# EAGLE design w14_MAKEYMAKEY-v03(2_3) (EAGLE 6.6.0)

## Sheet 1 of 2: i/o filters
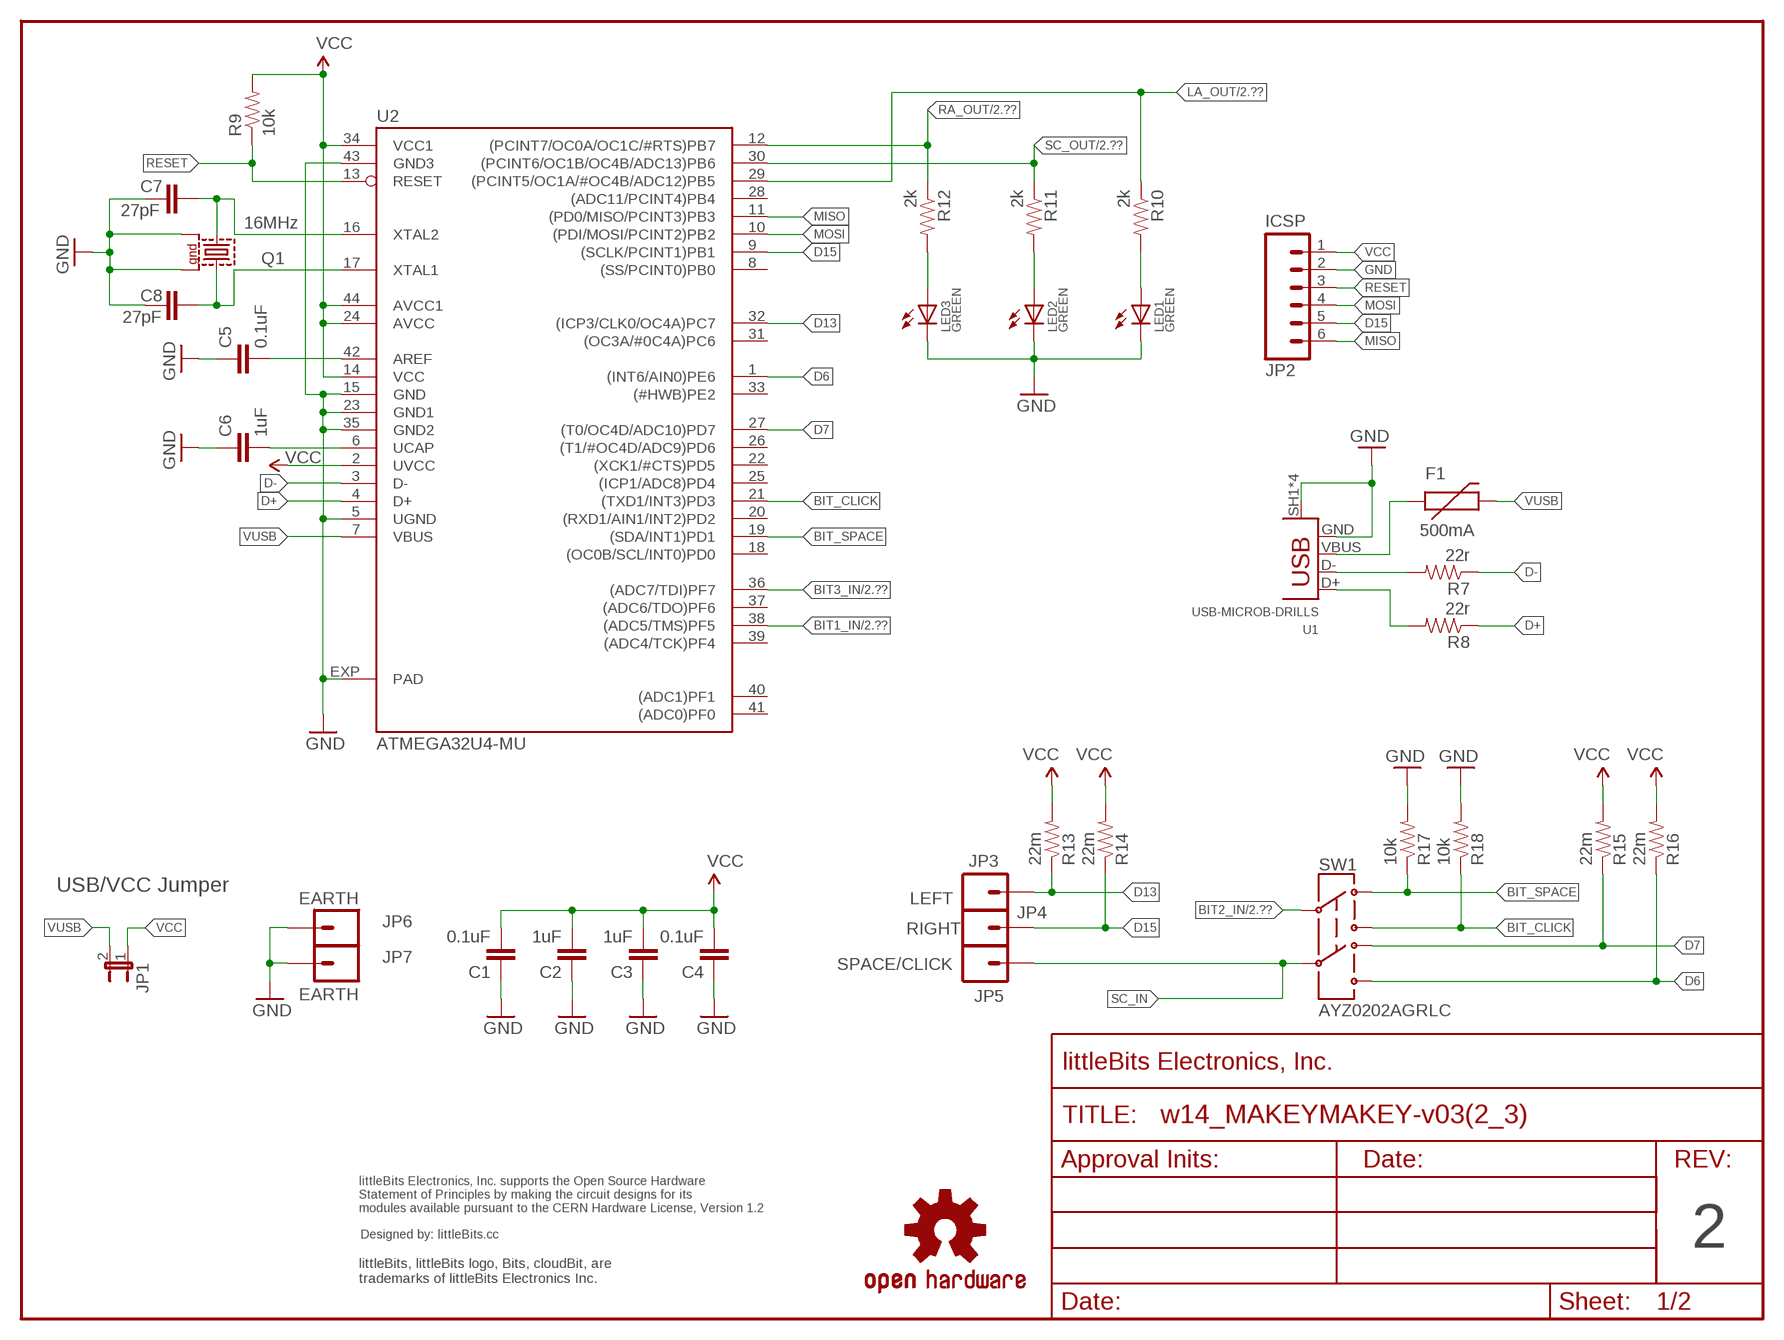
[diagram p0: schematic, sheet 1]

### Parts
C1  0.1uF  CAPCAP-0603  [CAP-0603]
C2  1uF  CAPCAP-0603  [CAP-0603]
C3  1uF  CAPCAP-0603  [CAP-0603]
C4  0.1uF  CAPCAP-0603  [CAP-0603]
C5  0.1uF  CAPCAP-0603  [CAP-0603]
C6  1uF  CAPCAP-0603  [CAP-0603]
C7  27pF  CAPCAP-0603  [CAP-0603]
C8  27pF  CAPCAP-0603  [CAP-0603]
F1  500mA  PTC  [PTC-1206]
JP1  JUMPER-2SMD-NO  [SJ_2S-NO]
JP2  ICSP  HRD-60.1INCH_NO_SILKSCREEN  [SIP6-SM-0.1IN-NOS.S.]
JP3  LEFT  M01ALLIGATOR-3MM  [1X01_ALLIGATOR_3MM]
JP4  RIGHT  M01ALLIGATOR-3MM  [1X01_ALLIGATOR_3MM]
JP5  SPACE/CLICK  M01ALLIGATOR-3MM  [1X01_ALLIGATOR_3MM]
JP6  EARTH  M01ALLIGATOR-3MM  [1X01_ALLIGATOR_3MM]
JP7  EARTH  M01ALLIGATOR-3MM  [1X01_ALLIGATOR_3MM]
LED1  GREEN  LED1206  [LED-1206]
LED2  GREEN  LED1206  [LED-1206]
LED3  GREEN  LED1206  [LED-1206]
Q1  16MHz  CRYSTAL-SMD-7B-SERIES-TXC  [CRYSTAL-SMD-7B-SERIES-5X3.2MM]
R7  22r  RESISTOR0603  [RES-0603]
R8  22r  RESISTOR0603  [RES-0603]
R9  10k  RESISTOR0603  [RES-0603]
R10  2k  RESISTOR0603  [RES-0603]
R11  2k  RESISTOR0603  [RES-0603]
R12  2k  RESISTOR0603  [RES-0603]
R13  22m  RESISTOR0603  [RES-0603]
R14  22m  RESISTOR0603  [RES-0603]
R15  22m  RESISTOR0603  [RES-0603]
R16  22m  RESISTOR0603  [RES-0603]
R17  10k  RESISTOR0603  [RES-0603]
R18  10k  RESISTOR0603  [RES-0603]
SW1  AYZ0202AGRLC  AYZ0202  [AYZ0202]
U1  USB-MICROB-DRILLS  [USB-MICROB-AUK-DRILLS]
U2  ATMEGA32U4-MU  ATMEGA32U4-XUMU  [QFN44ML7X7]
U$1  OSHWCREDIT  [OSHWCREDIT]
U$58  FRAME-LETTER-OHWOHW  [FABDWG01-OHW]
U$70  OSHW-LOGOL  [OSHW-LOGO-L]

### Nets
BIT1_IN: U2.38((ADC5/TMS)PF5) ; also sheet 2
BIT2_IN: SW1.2 ; also sheet 2
BIT3_IN: U2.36((ADC7/TDI)PF7) ; also sheet 2
BIT_CLICK: R18.1 SW1.3 U2.21((TXD1/INT3)PD3)
BIT_SPACE: R17.1 SW1.1 U2.19((SDA/INT1)PD1)
D6: R16.1 SW1.6 U2.1((INT6/AIN0)PE6)
D7: R15.1 SW1.4 U2.27((T0/OC4D/ADC10)PD7)
D13: JP3.1@0 JP3.1@2 R13.1 U2.32((ICP3/CLK0/OC4A)PC7)
D15: JP2.5 JP4.1@0 JP4.1@2 R14.1 U2.9((SCLK/PCINT1)PB1)
D+: R8.1 U2.4(D+)
D-: R7.1 U2.3(D-)
GND: C1.1 C2.1 C3.2 C4.1 C5.1 C6.1 C7.2 C8.2 JP2.2 JP6.1@0 JP6.1@2 JP7.1@0 JP7.1@2 LED1.C LED2.C LED3.C Q1.P$2 Q1.P$4 R17.2 R18.2 U1.GND U1.SH1(SH) U1.SH2(SH) U1.SH3(SH) U1.SH4(SH) U2.5(UGND) U2.15(GND) U2.23(GND1) U2.35(GND2) U2.43(GND3) U2.EXP(PAD) ; also sheet 2
LA_OUT: R10.1 U2.29((PCINT5/OC1A/#OC4B/ADC12)PB5) ; also sheet 2
MISO: JP2.6 U2.11((PD0/MISO/PCINT3)PB3)
MOSI: JP2.4 U2.10((PDI/MOSI/PCINT2)PB2)
N$1: LED3.A R12.2
N$4: LED1.A R10.2
N$5: LED2.A R11.2
N$12: C5.2 U2.42(AREF)
N$14: C7.1 Q1.P$3 U2.16(XTAL2)
N$15: R7.2 U1.D-
N$16: R8.2 U1.D+
N$17: F1.1 U1.VBUS
N$18: C8.1 Q1.P$1 U2.17(XTAL1)
N$19: C6.2 U2.6(UCAP)
RA_OUT: R12.1 U2.12((PCINT7/OC0A/OC1C/#RTS)PB7) ; also sheet 2
RESET: JP2.3 R9.1 U2.13(RESET)
SC_IN: JP5.1@0 JP5.1@2 SW1.5
SC_OUT: R11.1 U2.30((PCINT6/OC1B/OC4B/ADC13)PB6) ; also sheet 2
VCC: C1.2 C2.2 C3.1 C4.2 JP1.1 JP2.1 R9.2 R13.2 R14.2 R15.2 R16.2 U2.2(UVCC) U2.14(VCC) U2.24(AVCC) U2.34(VCC1) U2.44(AVCC1) ; also sheet 2
VUSB: F1.2 JP1.2 U2.7(VBUS)
Unconnected: U2.8((SS/PCINT0)PB0) U2.18((OC0B/SCL/INT0)PD0) U2.20((RXD1/AIN1/INT2)PD2) U2.22((XCK1/#CTS)PD5) U2.25((ICP1/ADC8)PD4) U2.26((T1/#OC4D/ADC9)PD6) U2.28((ADC11/PCINT4)PB4) U2.31((OC3A/#0C4A)PC6) U2.33((#HWB)PE2) U2.37((ADC6/TDO)PF6) U2.39((ADC4/TCK)PF4) U2.40((ADC1)PF1) U2.41((ADC0)PF0)

### Notes on the sheet
- USB/VCC Jumper
- 2

## Sheet 2 of 2
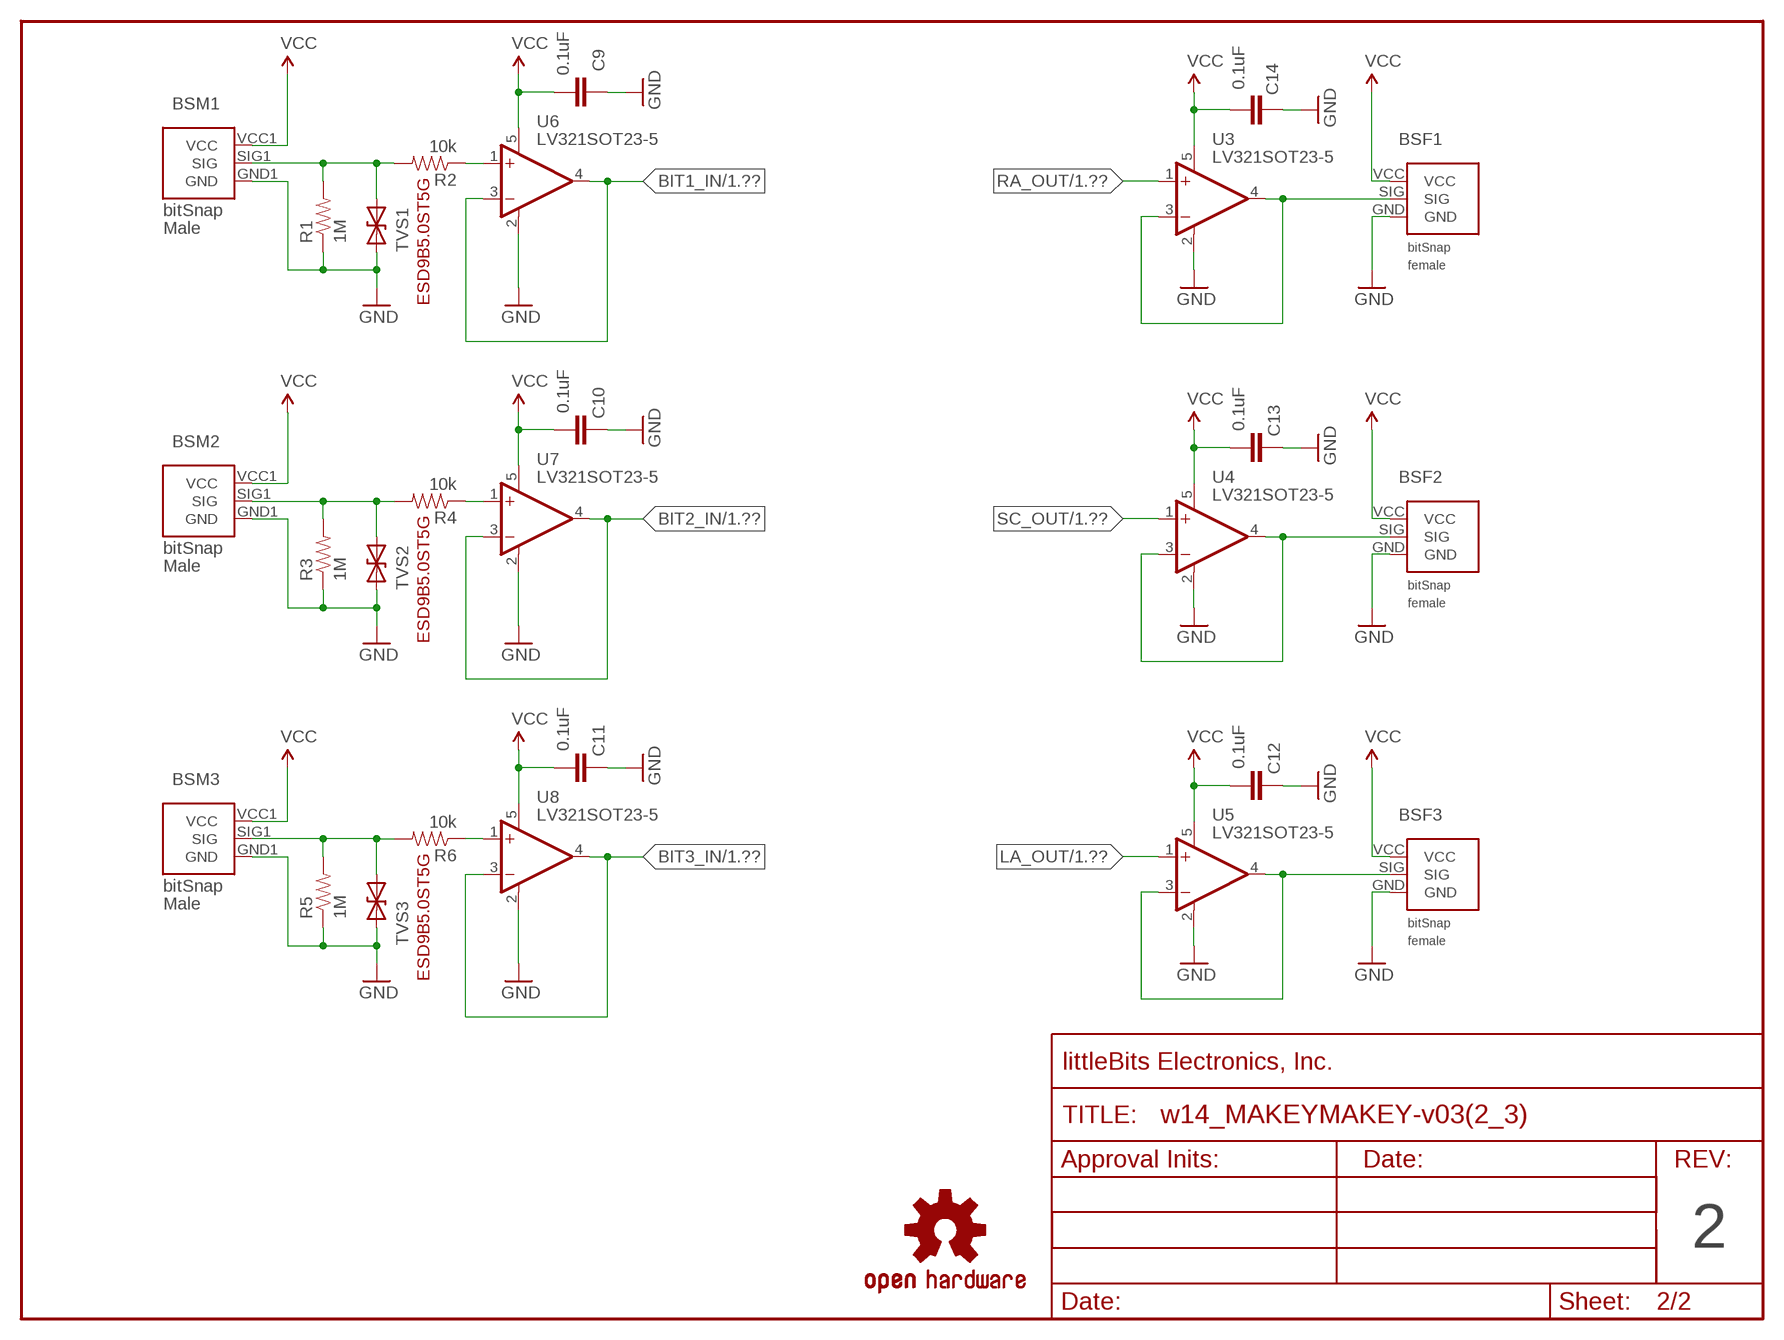
[diagram p1: schematic, sheet 2]

### Parts
BSF1  BITSNAP_V03_FEMALE  [BITSNAP_V03_FEMALE]
BSF2  BITSNAP_V03_FEMALE  [BITSNAP_V03_FEMALE]
BSF3  BITSNAP_V03_FEMALE  [BITSNAP_V03_FEMALE]
BSM1  BITSNAP_V03_MALE  [BITSNAP_V03_MALE]
BSM2  BITSNAP_V03_MALE  [BITSNAP_V03_MALE]
BSM3  BITSNAP_V03_MALE  [BITSNAP_V03_MALE]
C9  0.1uF  CAPCAP-0603  [CAP-0603]
C10  0.1uF  CAPCAP-0603  [CAP-0603]
C11  0.1uF  CAPCAP-0603  [CAP-0603]
C12  0.1uF  CAPCAP-0603  [CAP-0603]
C13  0.1uF  CAPCAP-0603  [CAP-0603]
C14  0.1uF  CAPCAP-0603  [CAP-0603]
R1  1M  RESISTOR0603  [RES-0603]
R2  10k  RESISTOR0603  [RES-0603]
R3  1M  RESISTOR0603  [RES-0603]
R4  10k  RESISTOR0603  [RES-0603]
R5  1M  RESISTOR0603  [RES-0603]
R6  10k  RESISTOR0603  [RES-0603]
TVS1  ESD9B5.0ST5G  DIODE-TVSSOD-923  [SOD-923]
TVS2  ESD9B5.0ST5G  DIODE-TVSSOD-923  [SOD-923]
TVS3  ESD9B5.0ST5G  DIODE-TVSSOD-923  [SOD-923]
U3  LV321SOT23-5  [SOT23-5]
U4  LV321SOT23-5  [SOT23-5]
U5  LV321SOT23-5  [SOT23-5]
U6  LV321SOT23-5  [SOT23-5]
U7  LV321SOT23-5  [SOT23-5]
U8  LV321SOT23-5  [SOT23-5]
U$2  FRAME-LETTER-OHWOHW  [FABDWG01-OHW]
U$56  OSHW-LOGOL  [OSHW-LOGO-L]

### Nets
BIT1_IN: U6.3(-IN) U6.4(OUT) ; also sheet 1
BIT2_IN: U7.3(-IN) U7.4(OUT) ; also sheet 1
BIT3_IN: U8.3(-IN) U8.4(OUT) ; also sheet 1
GND: BSF1.GND BSF2.GND BSF3.GND BSM1.GND1(GND) BSM2.GND1(GND) BSM3.GND1(GND) C9.1 C10.1 C11.1 C12.1 C13.1 C14.1 R1.1 R3.1 R5.1 TVS1.1(A) TVS2.1(A) TVS3.1(A) U3.2(V-) U4.2(V-) U5.2(V-) U6.2(V-) U7.2(V-) U8.2(V-) ; also sheet 1
LA_OUT: U5.1(+IN) ; also sheet 1
N$6: R4.1 U7.1(+IN)
N$10: R2.1 U6.1(+IN)
N$11: R6.1 U8.1(+IN)
RA_OUT: U3.1(+IN) ; also sheet 1
SC_OUT: U4.1(+IN) ; also sheet 1
SIG1_IN: BSM1.SIG1(SIG) R1.2 R2.2 TVS1.2(C)
SIG1_OUT: BSF1.SIG U3.3(-IN) U3.4(OUT)
SIG2_IN: BSM2.SIG1(SIG) R3.2 R4.2 TVS2.2(C)
SIG2_OUT: BSF2.SIG U4.3(-IN) U4.4(OUT)
SIG3_IN: BSM3.SIG1(SIG) R5.2 R6.2 TVS3.2(C)
SIG3_OUT: BSF3.SIG U5.3(-IN) U5.4(OUT)
VCC: BSF1.VCC BSF2.VCC BSF3.VCC BSM1.VCC1(VCC) BSM2.VCC1(VCC) BSM3.VCC1(VCC) C9.2 C10.2 C11.2 C12.2 C13.2 C14.2 U3.5(V+) U4.5(V+) U5.5(V+) U6.5(V+) U7.5(V+) U8.5(V+) ; also sheet 1

### Notes on the sheet
- 2

## Library data of the parts
BSF1-BSF3 = bitSnap:BITSNAP_V03_FEMALE
BSM1-BSM3 = bitSnap:BITSNAP_V03_MALE
C1-C14 = LITTLEBITS:CAP
F1 = LITTLEBITS:PTC
JP1 = LITTLEBITS:JUMPER-2: Jumper Basic 0.1" spaced jumper. Use with breakaway headers.
JP2 = LITTLEBITS:HRD-6
JP3-JP7 = SparkFun-Connectors:M01: Header 1 Standard 1-pin 0.1" header. Use with straight break away headers (SKU : PRT-00116), right angle break away headers (PRT-00553), swiss pins (PRT-00743), machine pins (PRT-00117), and female headers (PRT-00115).
LED1-LED3 = LITTLEBITS:LED
Q1 = LITTLEBITS:CRYSTAL-SMD-7B-SERIES-TXC; MFG: TXC; MPN: 7B SERIES
R1-R18 = LITTLEBITS:RESISTOR
SW1 = LITTLEBITS:AYZ0202
TVS1-TVS3 = LITTLEBITS:DIODE-TVS: Bidirectional Transient Voltage Suppression Diode: Device conducts in avalanche mode after reaching a part dependent voltage threshold. Used for limiting voltage spikes on ESD sensitive inputs and outputs.; IEC_ESD_PROT0: +/-18kV; LB_PN: ?; MPN: ESD9B5.0ST5G; V_CLAMP: ?; V_OPERATION: 5V
U1 = LITTLEBITS:USB-MICROB-DRILLS: AUK micro USB connector Part #: MCSB5ABSW-4-GXX-R1K-H; MFG: AUK; MPN: MCSB5ABSW-4-GXX-R1K-H
U2 = LITTLEBITS:ATMEGA32U4-XU
U3-U8 = LITTLEBITS:LV321
U$1 = LITTLEBITS:OSHWCREDIT
U$2 U$58 = LITTLEBITS:FRAME-LETTER-OHW
U$56 U$70 = LITTLEBITS:OSHW-LOGO: Open Source Hardware Logo This logo indicates the piece of hardware it is found on incorporates a OSHW license and/or adheres to the definition of open source hardware found here: http://freedomdefined.org/OSHW

## Board
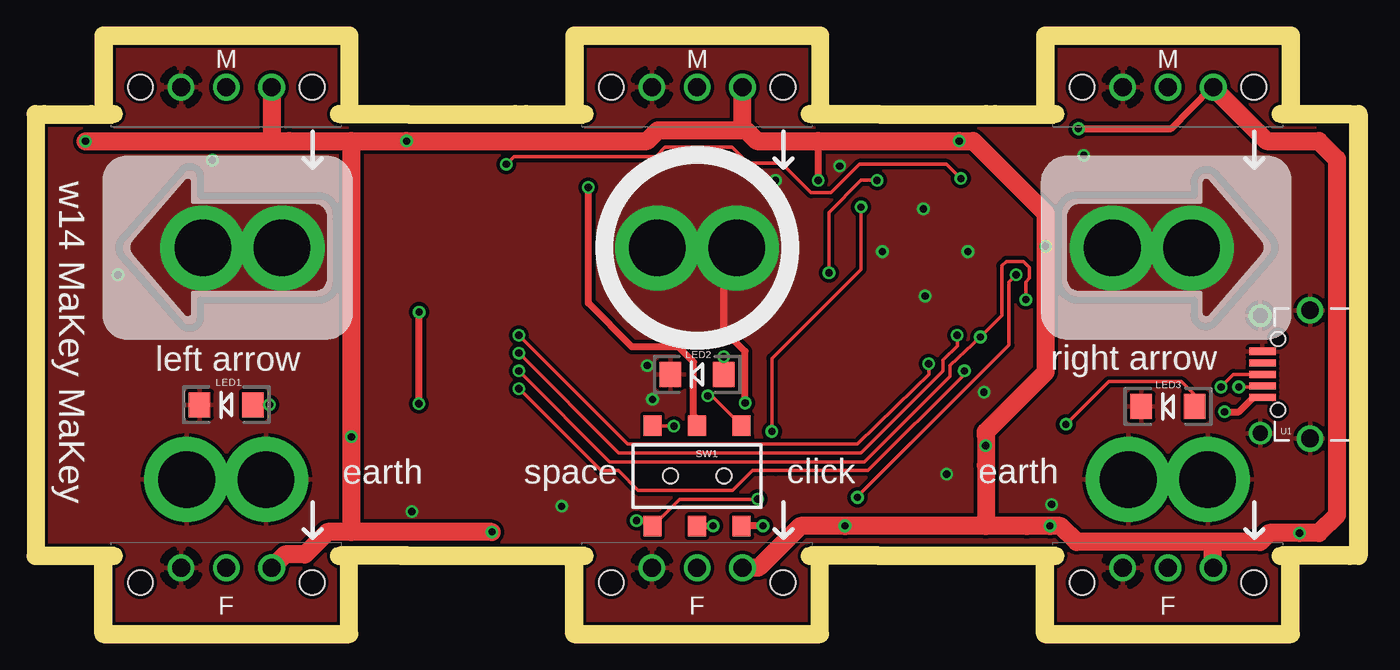
[diagram p2: board, top side]
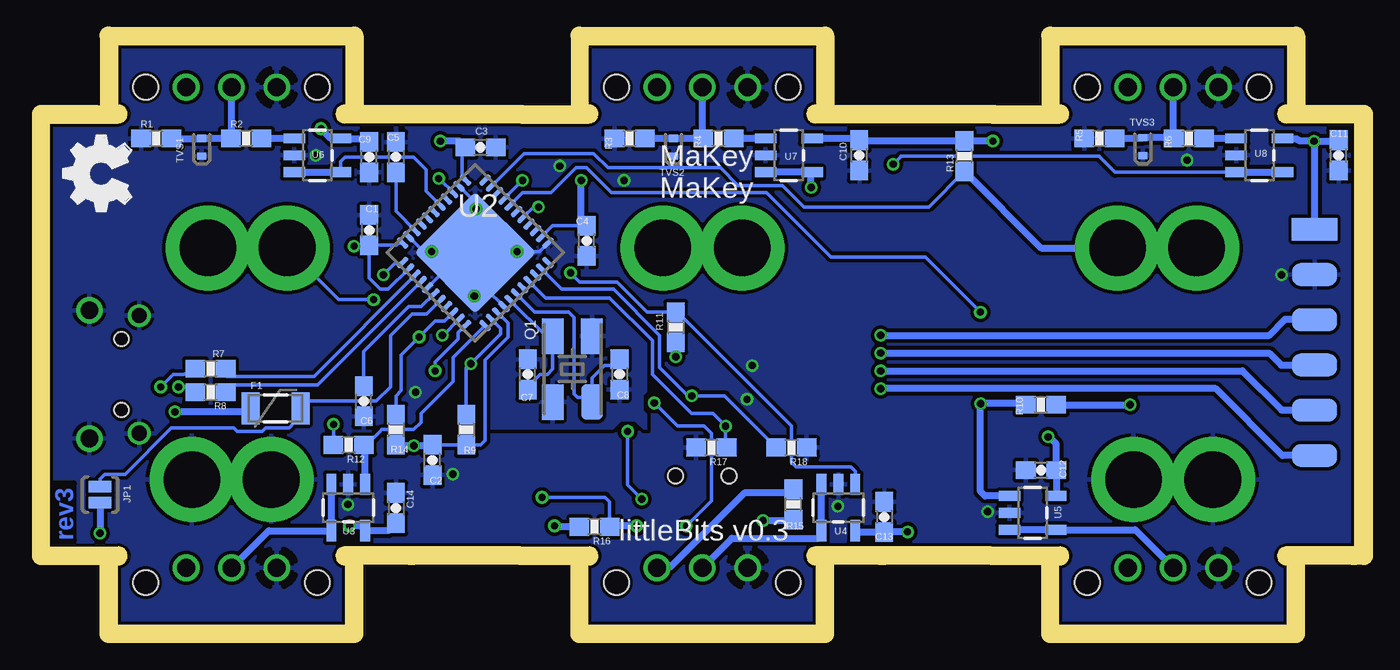
[diagram p3: board, bottom side, seen from below]

Size 73.24 x 32.61 mm. Coordinates in mm from the lower left corner, seen from the top.
Outline: 73.24,4.4 73.24,28.21
Outline: 20.4,28.21 26.42,28.21
Outline: 0,4.4 0,28.21
Outline: 20.4,4.4 26.42,4.4
Outline: 46.82,4.4 52.84,4.4
Outline: 46.82,28.21 52.84,28.21
Copper layers (1*16): Top 0.035mm / dielectric 1.5mm / Bottom 0.035mm
Design rules "littleBitsDRC": minimum track width 0.2mm, minimum drill 0.2mm, track to track 0.2mm, track to pad 0.2mm, pad to pad 0.2mm, via to via 0.2mm, smd to smd 0mil, copper to edge 0.2mm, drill to drill 0.2mm, minimum pad ring 0.1mm, minimum via ring 0.15mm, stop-mask expansion 0.1mm, vias tented up to drill 0.5mm, thermal gap 0.2mm
tRestrict: 30 lines
bRestrict: 17 lines
Milling: 10 lines

### Footprints (pad centres in the part's own frame; a part is rotated, then mirrored left to right if it is on the bottom)
BITSNAP_V03_FEMALE = drill 1: GND 4.065,3.44; SIG 6.605,3.44; VCC 9.145,3.44 | hole 1.4: 1.785,2.61; 11.425,2.61
BITSNAP_V03_MALE = drill 1: GND1 9.145,2.61; SIG1 6.605,2.61; VCC1 4.065,2.61 | hole 1.4: 1.785,2.61; 11.425,2.61
CAP-0603 = smd 1.1 x 1: 1 -0.85,0; 2 0.85,0
PTC-1206 = smd 1 x 1.8: 1 -1.4,0; 2 1.4,0
SJ_2S-NO = smd 0.635 x 1.27: 1 -0.45,0; 2 0.45,0
SIP6-SM-0.1IN-NOS.S. = smd 1.27 x 2.54: 1 -6.35,0; 2 -3.81,0; 3 -1.27,0; 4 1.27,0; 5 3.81,0; 6 6.35,0
1X01_ALLIGATOR_3MM = drill 3.175: 1@0 0,2.223; 1@2 0,-2.223
LED-1206 = smd 1.2 x 1.4: A -1.5,0; C 1.5,0
CRYSTAL-SMD-7B-SERIES-5X3.2MM = smd 2 x 1.2: P$1 -1.85,-1.1; P$2 1.85,-1.1; P$3 1.85,1.1; P$4 -1.85,1.1
RES-0603 = smd 1.1 x 1: 1 -0.85,0; 2 0.85,0
AYZ0202 = smd 1 x 1.15: 1 -2.5,2.825; 2 0,2.825; 3 2.5,2.825; 4 -2.5,-2.825; 5 0,-2.825; 6 2.5,-2.825 | hole 0.85: 1.5,0; -1.5,0
SOD-923 = smd 0.4 x 0.5: 1 -0.5,0; 2 0.5,0
USB-MICROB-AUK-DRILLS = smd 0.4 x 1.5: D+ 0,2.67; D- -0.65,2.67; GND 1.3,2.67; ID 0.65,2.67; VBUS -1.3,2.67 | drill 0.85: SH1 -3.3,2.8; SH2 3.3,2.8 | drill 1: SH3 -3.6,0; SH4 3.6,0 | hole 0.8: -2,1.8; 2,1.8
QFN44ML7X7 = smd 0.75 x 0.275: 1 -3.275,2.5; 2 -3.275,2; 3 -3.275,1.5; 4 -3.275,1; 5 -3.275,0.5; 6 -3.275,0; 7 -3.275,-0.5; 8 -3.275,-1; 9 -3.275,-1.5; 10 -3.275,-2; 11 -3.275,-2.5; 23 3.275,-2.5; 24 3.275,-2; 25 3.275,-1.5; 26 3.275,-1; 27 3.275,-0.5; 28 3.275,0; 29 3.275,0.5; 30 3.275,1; 31 3.275,1.5; 32 3.275,2; 33 3.275,2.5 | smd 0.275 x 0.75: 12 -2.5,-3.275; 13 -2,-3.275; 14 -1.5,-3.275; 15 -1,-3.275; 16 -0.5,-3.275; 17 0,-3.275; 18 0.5,-3.275; 19 1,-3.275; 20 1.5,-3.275; 21 2,-3.275; 22 2.5,-3.275; 34 2.5,3.275; 35 2,3.275; 36 1.5,3.275; 37 1,3.275; 38 0.5,3.275; 39 0,3.275; 40 -0.5,3.275; 41 -1,3.275; 42 -1.5,3.275; 43 -2,3.275; 44 -2.5,3.275 | smd 4.826 x 4.826: EXP 0,0
SOT23-5 = smd 0.55 x 1.2: 1 -0.95,-1.3; 2 0,-1.3; 3 0.95,-1.3; 4 0.95,1.3; 5 -0.95,1.3

### Placement (x,y rotation side)
BSF1  56.44,-0.21 0 top
BSF2  30.02,-0.21 0 top
BSF3  3.59,-0.21 0 top
BSM1  69.65,32.82 180 top
BSM2  43.23,32.82 180 top
BSM3  16.8,32.82 180 top
C1  55.31,22.18 270 bottom
C2  51.77,9.29 90 bottom
C3  49.06,26.83 0 bottom
C4  43.12,21.58 90 bottom
C5  53.81,26.29 270 bottom
C6  55.62,12.58 90 bottom
C7  46.41,14.08 90 bottom
C8  41.27,14.08 270 bottom
C9  55.31,26.29 90 bottom
C10  27.82,26.39 90 bottom
C11  0.91,26.39 90 bottom
C12  17.62,8.71 0 bottom
C13  26.41,6.08 270 bottom
C14  53.81,6.58 270 bottom
F1  60.56,12.18 0 bottom
JP1  70.41,7.33 90 bottom
JP2  2.27,15.88 270 bottom
JP3  11.1,21.18 90 top
JP4  62.14,21.18 90 top
JP5  36.62,21.18 90 top
JP6  10.2,8.18 90 top
JP7  63.04,8.18 90 top
LED1  10.2,12.38 180 top
LED2  36.62,14.08 180 top
LED3  63.04,12.29 180 top
Q1  43.91,14.38 90 bottom
R1  67.26,27.33 0 bottom
R2  62.22,27.33 180 bottom
R3  40.7,27.33 0 bottom
R4  35.72,27.33 180 bottom
R5  14.34,27.33 0 bottom
R6  9.32,27.33 180 bottom
R7  64.22,14.4 180 bottom
R8  64.22,13.08 180 bottom
R9  49.87,10.98 270 bottom
R10  17.62,12.38 0 bottom
R11  38.12,16.73 270 bottom
R12  56.47,10.13 180 bottom
R13  21.91,26.33 90 bottom
R14  53.81,10.98 270 bottom
R15  31.52,6.78 90 bottom
R16  42.66,5.53 180 bottom
R17  36.12,9.98 180 bottom
R18  31.62,9.98 0 bottom
SW1  36.62,8.38 0 top
TVS1  64.72,26.83 90 bottom
TVS2  38.23,26.83 90 bottom
TVS3  11.91,26.87 90 bottom
U1  71.02,14.08 90 top
U2  49.37,20.91 45 bottom
U3  56.49,6.61 180 bottom
U4  28.99,6.61 180 bottom
U5  18.09,6.32 270 bottom
U6  58.22,26.39 270 bottom
U7  31.77,26.39 270 bottom
U8  5.37,26.39 270 bottom
U$1  -59.51,-62.54 0 top  (outside the outline)
U$2  30.02,-6.82 0 top  (outside the outline)
U$5  [OSHW_FILLX150_NOTEXT]  68.67,22.41 0 top
U$56  2.32,-68.86 0 top  (outside the outline)
U$58  30.02,-6.82 0 top  (outside the outline)
U$70  2.32,-68.86 0 top  (outside the outline)

### Tracks (layer width: path | path; a pad name or v marks a point on that pad's centre or on a via)
BIT1_IN
  Bottom 0.2: U6.4 56.91,26.03 56.66,26.29 52.81,26.29 52.12,25.58 52.12,24.38
  Bottom 0.203: 52.12,24.38 51.33,23.6 U2.38
  Bottom 0.406: U6.3 U6.4
BIT2_IN  (via drill 0.41)
  Top 0.203: 36.62,11.58 SW1.2
  Top 0.406: v30.52,24.58 30.52,18.08 32.97,15.63 35.56,15.63 36.41,14.79 36.41,11.79 36.62,11.58
  Bottom 0.203: 30.52,25.39 U7.4
  Bottom 0.406: U7.4 U7.3 | v30.52,24.58 30.52,25.39
BIT3_IN  (via drill 0.41)
  Top 0.203: v51.41,25.08 50.62,25.89 45.72,25.89 44.12,24.29 43.02,24.29 41.37,25.93 39.47,25.93 38.56,26.83 34.81,26.83 34.3,26.32 26.36,26.32
  Top 0.204: v25.91,25.89 26.36,26.32
  Bottom 0.2: 25.48,26.32 25.46,26.33 14.36,26.33 14.36,26.32
  Bottom 0.203: U2.36 50.62,24.31 51.31,25.01
  Bottom 0.204: U8.3 13.46,25.43 14.36,26.32 | 25.48,26.32 v25.91,25.89 | v51.41,25.08 51.31,25.01
  Bottom 0.406: U8.3 U8.4
BIT_CLICK  (via drill 0.41)
  Top 0.203: v37.22,12.88 37.44,12.88 SW1.3
  Bottom 0.2: 44.52,18.88 41.62,18.88 39.02,16.29 39.02,14.48 37.41,12.88 v37.22,12.88 | U2.21
  Bottom 0.203: v37.22,12.88 35.37,12.88 32.77,10.28 R18.1 | 44.52,18.88 U2.21
BIT_SPACE  (via drill 0.41)
  Top 0.203: v35.31,11.18 34.14,11.18 SW1.1
  Bottom 0.2: 37.22,11.88 39.41,14.08 39.41,15.98 41.81,18.38 45.42,18.38 U2.19
  Bottom 0.203: 37.22,11.88 36.02,11.88 v35.31,11.18 35.31,10.04 R17.1
D6  (via drill 0.41)
  Top 0.2: v54.52,19.68 54.12,19.29 54.12,15.73
  Top 0.203: 39.14,5.58 SW1.6 | 54.12,15.73 45.62,7.24 v45.62,7.18
  Top 0.406: v40.31,5.58 39.14,5.58
  Bottom 0.203: 41.77,5.58 R16.1 41.81,6.93 42.07,7.18 v45.62,7.18 | v54.52,19.68 53.9,20.3 53.52,20.3 U2.1
  Bottom 0.406: v40.31,5.58 41.77,5.58
D7  (via drill 0.41)
  Top 0.203: 34.29,5.56 SW1.4 | 33.79,5.88 SW1.4 | 33.99,5.88 SW1.4 | v40.02,7.08 35.64,7.08 SW1.4 | v45.81,23.48 45.81,19.98 40.81,14.98 v40.81,10.88
  Top 0.406: v33.22,5.88 33.99,5.88
  Bottom 0.203: 31.66,5.88 arc-90 R15.1 | v45.81,23.48 46.02,23.56 U2.27 | v40.02,7.08 40.81,7.88 v40.81,10.88
  Bottom 0.406: v33.22,5.88 31.66,5.88
D13
  Bottom 0.2: 30.91,23.48 32.12,24.68 34.62,24.68 35.62,25.68 41.91,25.68 42.72,26.48 46.62,26.48
  Bottom 0.203: 47.12,25.98 U2.32
  Bottom 0.204: R13.1 23.91,23.48 30.91,23.48 | 46.62,26.48 47.12,25.98
  Bottom 0.406: JP3.1@0 JP3.1@2 17.62,21.18 R13.1
  pour Top (no thermals): 8.53,18.45 15.33,18.45 arc90 16.15,19.26 16.15,23.12 arc90 15.33,23.93 8.53,23.93 8.53,25.27 arc139 7.83,25.35 4.57,21.6 arc81 4.57,20.78 7.83,17.03 arc139 8.53,17.31
D15  (via drill 0.41)
  Top 0.2: v26.62,14.29 31.71,9.18 46.02,9.18 50.81,13.98 50.81,14.58 v52.52,16.18 53.72,17.38 53.72,20.18 | v55.06,18.29 55.06,19.29 55.27,19.48
  Top 0.203: 55.27,19.48 55.27,20.08 54.91,20.43 53.97,20.43 53.72,20.18
  Bottom 0.2: 51.72,16.98 51.62,17.08 51.09,17.08 | v55.06,18.29 57.02,18.29 57.32,18.58
  Bottom 0.203: 2.36,11.98 JP2.5 | R14.1 53.81,12.88 53.52,13.18 53.52,15.18 v52.52,16.18 51.72,16.98 | 57.32,18.58 JP4.1@0 | U2.9 51.07,17.08 51.09,17.08
  Bottom 0.406: v26.62,14.29 6.32,14.29 4.12,12.08 JP2.5
  pour Top (rank 2, no thermals): 64.72,23.94 57.91,23.94 arc90 57.09,23.13 57.09,19.47 arc90 58.01,18.46 64.72,18.46 64.72,17.42 arc139 65.51,17.14 68.67,20.79 arc81 68.67,21.61 65.51,25.26 arc139 64.72,24.78
D+
  Bottom 0.203: R8.1 63.66,13.13 63.31,13.48 58.21,13.48 U2.4
D-
  Bottom 0.203: R7.1 63.66,14.33 63.31,13.98 58.42,13.98 U2.3
GND  (via drill 0.41)
  Bottom 0.203: U2.15 48.75,18.88 48.91,18.88 | 48.91,18.88 49.31,18.48 v49.41,18.48 | U2.23 45.76,20.98 v47.02,20.98 | U2.35 49.31,23.69 v49.31,23.38 | U2.43 52.26,20.98 v51.81,20.98 51.81,20.88 51.02,20.08 51.02,19.97 U2.5 | 48.91,18.88 49.37,19.33 U2.EXP
  other vias: 44.62,25.79 41.02,24.98 29.02,6.68 20.62,6.38 56.52,6.78 58.31,26.39 9.41,26.11 4.12,19.68 33.81,14.58 34.12,12.68 52.72,13.08 50.62,8.48
  pour Top (rank 6): -0.96,-0.24 -0.96,32.73 74,32.73 73.8,-0.24
  pour Bottom: -0.96,-0.24 -0.96,32.73 74,32.73 73.9,-0.24
LA_OUT  (via drill 0.41)
  Top 0.406: v21.01,12.45 21.01,17.38 v21.02,17.58
  Bottom 0.2: 29.41,20.68 33.02,24.29 41.72,24.29 43.12,25.68 43.72,25.68 45.12,24.29 46.72,24.29
  Bottom 0.203: U2.29 47.4,23.6 46.72,24.29 | 24.12,20.68 29.41,20.68
  Bottom 0.204: v21.02,17.58 24.12,20.68
  Bottom 0.406: U5.1 20.75,7.26 21.01,7.52 v21.01,12.45 18.52,12.45 R10.1
MISO  (via drill 0.41)
  Top 0.2: 40.41,8.68 41.02,8.68
  Top 0.203: 41.02,8.68 46.22,8.68 51.62,14.08 v51.62,14.29 | v26.62,13.29 31.21,8.68 32.22,8.68 33.31,7.58 38.62,7.58 39.72,8.68 40.41,8.68
  Bottom 0.203: v51.62,14.29 51.62,14.79 50.31,16.08 50.31,16.43 U2.11
  Bottom 0.4: 7.82,13.29 v26.62,13.29
  Bottom 0.406: JP2.6 4.07,9.54 7.82,13.29
MOSI  (via drill 0.41)
  Top 0.2: v26.62,15.29 32.22,9.68 45.81,9.68 50.41,14.29 50.41,14.88
  Top 0.203: 50.41,14.88 51.22,15.68 v51.22,16.29
  Bottom 0.203: U2.10 51.17,16.29 v51.22,16.29
  Bottom 0.406: v26.62,15.29 4.82,15.29 4.14,14.61 JP2.4
N$1  (via drill 0.41)
  Top 0.203: LED3.A 64.54,12.93 63.79,13.68 59.72,13.68 v57.31,11.29
  Bottom 0.203: v57.31,11.29 R12.2
N$4  (via drill 0.41)
  Top 0.203: v12.62,12.38 LED1.A
  Bottom 0.406: R10.2 v12.62,12.38
N$5  (via drill 0.41)
  Top 0.203: 38.12,13.98 LED2.A v38.12,15.08
  Top 0.406: LED2.A 38.22,13.68
  Bottom 0.203: R11.2 v38.12,15.08
N$6
  Bottom 0.406: U7.1 R4.1
N$10
  Bottom 0.406: U6.1 R2.1
N$11
  Bottom 0.406: U8.1 R6.1
N$12
  Bottom 0.203: U2.42 53.81,23.24 C5.2
N$14
  Bottom 0.203: U2.16 45.39,16.23 Q1.P$3 45.02,14.38 45.31,14.08 45.72,14.08 46.41,13.38 C7.1 46.41,13.48
N$15  (via drill 0.41)
  Top 0.203: U1.D- 67.97,13.43 67.91,13.38 v67.02,13.38
  Bottom 0.203: v67.02,13.38 66.31,14.08 65.72,14.08 R7.2
N$16  (via drill 0.41)
  Top 0.2: U1.D+ 66.72,14.08
  Top 0.203: v66.02,13.38 66.72,14.08
  Bottom 0.203: R8.2 65.52,13.38 v66.02,13.38
N$17  (via drill 0.41)
  Top 0.406: v66.22,11.98 67.02,11.98 67.81,12.79 U1.VBUS
  Bottom 0.406: F1.1 62.37,11.98 v66.22,11.98
N$18
  Bottom 0.203: U2.17 46.03,17.58 44.12,17.58 43.81,17.29 43.81,12.98 43.62,12.79 43.06,12.79 arc90 Q1.P$1 42.81,13.88 42.12,14.58 41.62,14.58 C8.1 41.56,14.93
N$19
  Bottom 0.2: U2.6 52.39,17.88 53.12,17.88 55.62,15.38
  Bottom 0.203: 55.62,15.38 C6.2
RA_OUT
  Bottom 0.2: 54.72,10.88 54.62,10.98 52.81,10.98 52.41,11.38
  Bottom 0.203: U2.12 50.62,15.03 50.62,13.68 52.41,11.88 52.41,11.38 | 54.72,10.88 55.47,10.13 R12.1 55.54,10.06
  Bottom 0.406: U3.1 55.54,10.06
RESET  (via drill 0.41)
  Top 0.2: 45.62,10.18 32.72,10.18 v26.62,16.29
  Top 0.203: 45.62,10.18 48.81,13.29 49.62,14.08 v49.62,14.68
  Bottom 0.2: v49.62,14.68 47.94,16.36 47.94,16.66 U2.13
  Bottom 0.203: 2.3,17.18 JP2.3 | v49.62,14.68 49.87,14.43 R9.1
  Bottom 0.406: v26.62,16.29 4.82,16.29 3.91,17.18 2.3,17.18
SC_IN  (via drill 0.41)
  Top 0.203: SW1.5 36.64,5.58 | 38.22,21.18 JP5.1@2 | 38.12,21.08 38.22,21.18 | 38.22,21.18 JP5.1@0
  Top 0.406: 36.64,5.58 v37.52,5.58 | v39.31,12.48 39.31,15.38 38.12,16.58 38.12,21.08
  Bottom 0.2: v39.31,12.48 38.02,11.18 36.52,11.18 36.12,10.79 36.12,6.99 v37.52,5.58
  pour Top (no thermals): 36.56,26.08 arc90 31.68,21.2 31.68,21.13 arc90 36.62,16.29 arc90 41.52,21.18 arc90
SC_OUT  (via drill 0.41)
  Top 0.203: v46.72,24.98 45.81,24.98 44.02,23.18 v44.02,19.79
  Bottom 0.2: 31.62,9.14 31.62,11.18 | 39.72,17.58 41.41,19.29 43.52,19.29 v44.02,19.79
  Bottom 0.203: 46.73,24.98 v46.72,24.98 U2.30 | U4.1 28.04,8.63 28.29,8.88 31.36,8.88 31.62,9.14 | 31.62,11.18 37.72,17.29 R11.1 39.72,17.58
SIG1_IN
  Bottom 0.2: BSM1.SIG1 63.06,30.18
  Bottom 0.406: R1.2 TVS1.2 R2.2 63.06,30.18
SIG1_OUT
  Bottom 0.203: U3.4 57.44,5.24
  Bottom 0.406: U3.3 U3.4 60.95,5.32 BSF1.SIG
SIG2_IN
  Bottom 0.2: R4.2 36.62,27.59
  Bottom 0.406: R4.2 TVS2.2 R3.2 | 36.62,27.59 BSM2.SIG1
SIG2_OUT
  Bottom 0.4: BSF2.SIG 34.97,4.88 30.12,4.88 29.94,5.08
  Bottom 0.406: U4.3 U4.4 29.94,5.08
SIG3_IN
  Bottom 0.2: 10.2,27.58 10.21,27.57 10.41,27.37 | TVS3.2 11.95,27.33
  Bottom 0.406: R6.2 10.21,27.57 | 10.2,27.58 BSM3.SIG1 | 10.41,27.37 TVS3.2 | 11.95,27.33 R5.2
SIG3_OUT
  Bottom 0.406: BSF3.SIG 12.34,5.36 U5.4 U5.3
VCC  (via drill 0.41)
  Top 0.4: v43.41,24.98 43.41,27.18 | 65.5,30.21 BSM1.VCC1
  Top 0.406: 54.52,5.68 55.12,5.58 | v58.02,27.89 63.22,27.89 65.5,30.21 | v52.81,10.08 53.02,8.79 52.81,8.98
  Top 1: 65.56,4.68 57.91,4.68 | 52.12,27.18 56.16,23.13 v56.16,21.29 56.16,14.21 52.81,10.86 52.81,10.68
  Top 1.016: 17.21,5.25 v17.21,10.58 17.21,27.18 | BSF3.VCC 13.5,3.99 14.62,3.99 15.88,5.25 17.21,5.25 | 52.12,27.18 v51.31,27.18 43.41,27.18 39.97,27.18 39.37,27.79 39.22,27.79 | BSF2.VCC 40.06,3.23 42.41,5.58 v44.91,5.58 52.81,5.58 | BSM1.VCC1 65.68,30.08 68.58,27.18 71.52,27.18 72.52,26.18 72.52,6.18 71.52,5.18 v70.41,5.18 68.72,5.18 68.22,4.68 65.56,4.68 65.56,3.25 BSF1.VCC | BSM2.VCC1 39.16,27.84 39.22,27.79 | 17.21,27.18 13.74,27.18 12.82,27.18 | 17.21,27.18 v20.32,27.18 33.81,27.18 34.41,27.79 39.22,27.79 | 57.91,4.68 57.02,5.58 v56.41,5.58 55.12,5.58 52.81,5.58 | BSM3.VCC1 12.74,27.26 12.82,27.18 | v2.3,27.18 12.82,27.18 | v25.11,5.25 17.21,5.25 | 52.81,10.68 52.81,8.98 52.81,5.58
  Bottom 0.2: 48.81,10.39 48.81,14.88 47.52,16.18 47.52,16.96 48.09,17.54 | 54.24,18.88 54.72,18.88 55.31,19.48 | C2.2 R9.2 49.07,10.13
  Bottom 0.203: 50,26.62 C3.1 50.12,26.83 50.12,25.2 U2.34 | C14.2 54.23,5.32 | C4.2 45.04,22.43 45.63,21.84 U2.24 | 48.81,10.39 49.07,10.13 | C1.2 53.77,21.33 53.64,21.46 U2.44 | U2.2 53.12,20.01 54.24,18.88 | 48.09,17.54 U2.14 | C1.2 55.37,21.29 v56.16,21.29 56.22,21.29 | 55.31,19.48 C1.2
  Bottom 0.406: C2.2 52.02,10.08 53.62,10.08 R14.2 53.72,10.08 v52.81,10.08 | 54.23,5.32 U3.5 arc-90 55.81,5.58 v56.41,5.58 | U7.5 27.91,27.33 C10.2 | U5.5 16.77,7.26 C12.2 16.77,10.18 17.17,10.58 v17.21,10.58 | JP1.1 v70.41,5.18 | 1.32,22.23 JP2.1 2.27,27.04 2.2,27.18 | U4.5 27.96,5.24 C13.2 v25.11,5.25 | R16.2 44.87,5.53 v44.91,5.58 | 1.02,27.33 C11.2 0.96,27.18 2.2,27.18 | U8.5 4.02,27.29 3.21,27.29 3.12,27.18 v2.3,27.18 2.2,27.18 | R15.2 31.62,7.49 31.62,7.43 34.27,7.43 38.47,3.23 BSF2.VCC | C9.2 arc-90 55.52,27.33 U6.5 57.47,27.33 v58.02,27.89 | C3.1 50.27,27.18 v51.31,27.18 | v20.32,27.18 R13.2 27.82,27.18 | C4.2 43.41,22.48 v43.41,24.98
  Bottom 1.016: C13.2 | 27.82,27.18 C10.2
VUSB
  Bottom 0.2: 54.91,12.58 58.81,12.58 | 62.72,10.88 61.31,10.88 | 62.91,11.08 66.41,11.08 69.02,8.48 70.16,8.48 70.41,8.23 JP1.2 | 54.12,16.29 52.91,17.48 52.09,17.48 U2.7
  Bottom 0.203: 54.12,16.29 54.12,13.38 54.91,12.58 | 58.81,12.58 59.31,12.08 F1.2 59.31,12.04 59.52,11.38 59.81,11.08 61.12,11.08 61.31,10.88 | 69.91,7.78 JP1.2 | 62.91,11.08 62.72,10.88

### Text on the board
Bottom: rev3
tPlace: w14 MaKey MaKey | left arrow | right arrow | earth | space | click | earth
bPlace: MaKey / MaKey | littleBits v0.3
dxf: 3 | Makey Makey Bit